# Altium schematic sheet KV2_MotionB67.SchDoc
size A3; PageSetup: Record=PageOptions|CenterHorizontal=True|CenterVertical=True|PrintScale=1.00|XCorrection=1.00|YCorrection=1.00|PrintKind=2|BorderSize=5000000|LeftOffset=0|BottomOffset=0|Orientation=2|PaperLength=1000|PaperWidth=1000|Scale=100|PaperSource=7|PrintQuality=-4|MediaType=1|DitherType=10|PaperKind=A3|PrintScaleMode=1
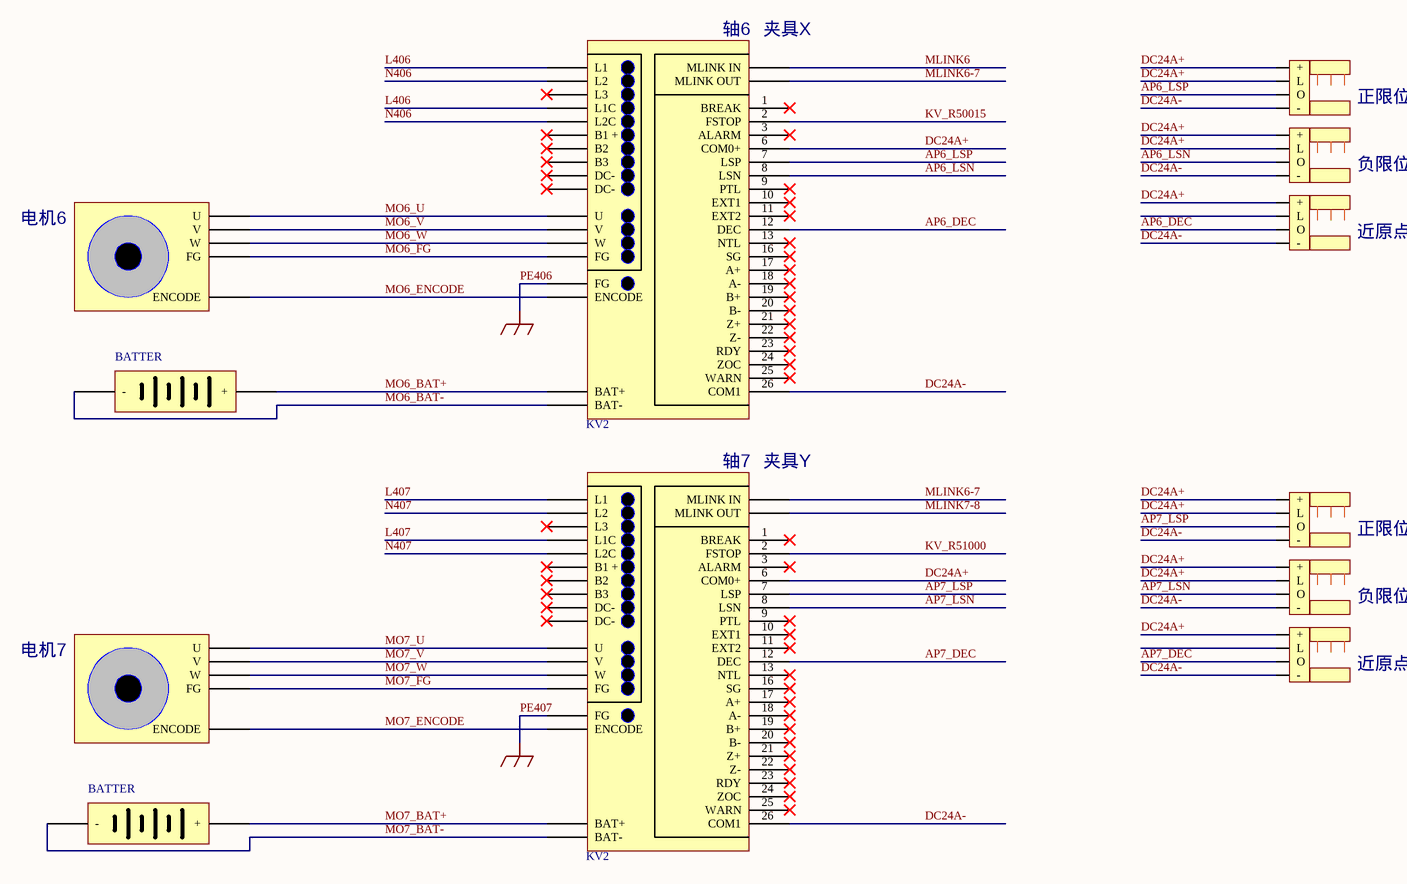
[diagram p0: KV2_MotionB67.SchDoc]

## Parts
(Parts that share a designator on the sheet are numbered #1, #2 ... from top to bottom, then left to right.)
*#1  KV2
*#2  SV-MXXXX  (value not drawn)
*#3  BATTER
*#4  KV2
*#5  SV-MXXXX  (value not drawn)
*#6  BATTER
原点光纤传感器#1  OMRON  E3X-HD  (value not drawn)
原点光纤传感器#2  OMRON  E3X-HD  (value not drawn)
原点光纤传感器#3  OMRON  E3X-HD  (value not drawn)
原点光纤传感器#4  OMRON  E3X-HD  (value not drawn)
原点光纤传感器#5  OMRON  E3X-HD  (value not drawn)
原点光纤传感器#6  OMRON  E3X-HD  (value not drawn)

## Nets
PE406: *#1.X43(FG) *#4.X43(FG)  [also labelled GND, PE407]
AP6_DEC: *#1.12(DEC) 原点光纤传感器#3.91(O)
AP6_LSN: *#1.8(LSN) 原点光纤传感器#2.91(O)
AP6_LSP: *#1.7(LSP) 原点光纤传感器#1.91(O)
AP7_DEC: *#4.12(DEC) 原点光纤传感器#6.91(O)
AP7_LSN: *#4.8(LSN) 原点光纤传感器#5.91(O)
AP7_LSP: *#4.7(LSP) 原点光纤传感器#4.91(O)
DC24A+: *#1.6(COM0+) *#4.6(COM0+) 原点光纤传感器#1.89(+) 原点光纤传感器#1.90(L) 原点光纤传感器#2.89(+) 原点光纤传感器#2.90(L) 原点光纤传感器#3.89(+) 原点光纤传感器#4.89(+) 原点光纤传感器#4.90(L) 原点光纤传感器#5.89(+) 原点光纤传感器#5.90(L) 原点光纤传感器#6.89(+)
DC24A-: *#1.26(COM1) *#4.26(COM1) 原点光纤传感器#1.92(-) 原点光纤传感器#2.92(-) 原点光纤传感器#3.92(-) 原点光纤传感器#4.92(-) 原点光纤传感器#5.92(-) 原点光纤传感器#6.92(-)
KV_R50015: *#1.2(FSTOP)
KV_R51000: *#4.2(FSTOP)
L406: *#1.X34(L1) *#1.X37(L1C)
L407: *#4.X34(L1) *#4.X37(L1C)
MLINK6: *#1.X44(MLINK_IN)
MLINK6-7: *#1.X44(MLINK_OUT) *#4.X44(MLINK_IN)
MLINK7-8: *#4.X44(MLINK_OUT)
MO6_BAT+: *#1.X44(BAT+) *#3.33(+)
MO6_BAT-: *#1.X44(BAT-) *#3.32(-)
MO6_ENCODE: *#1.X44(ENCODE) *#2.29(ENCODE)
MO6_FG: *#1.X43(FG) *#2.29(FG)
MO6_U: *#1.X43(DC-) *#2.27(U)
MO6_V: *#1.X43(V) *#2.28(V)
MO6_W: *#1.X43(W) *#2.29(W)
MO7_BAT+: *#4.X44(BAT+) *#6.33(+)
MO7_BAT-: *#4.X44(BAT-) *#6.32(-)
MO7_ENCODE: *#4.X44(ENCODE) *#5.29(ENCODE)
MO7_FG: *#4.X43(FG) *#5.29(FG)
MO7_U: *#4.X43(DC-) *#5.27(U)
MO7_V: *#4.X43(V) *#5.28(V)
MO7_W: *#4.X43(W) *#5.29(W)
N406: *#1.X35(L2) *#1.X38(L2C)
N407: *#4.X35(L2) *#4.X38(L2C)

Not connected (* = marked no-connect by the designer): *#1 1(BREAK)* 3(ALARM)* 9(PTL)* 10(EXT1)* 11(EXT2)* 13(NTL)* 16(SG)* 17(A+)* 18(A-)* 19(B+)* 20(B-)* 21(Z+)* 22(Z-)* 23(RDY)* 24(ZOC)* 25(WARN)* X36(L3)* X39(B1_+)* X40(B2)* X41(B3)* X42(DC-)*; *#4 1(BREAK)* 3(ALARM)* 9(PTL)* 10(EXT1)* 11(EXT2)* 13(NTL)* 16(SG)* 17(A+)* 18(A-)* 19(B+)* 20(B-)* 21(Z+)* 22(Z-)* 23(RDY)* 24(ZOC)* 25(WARN)* X36(L3)* X39(B1_+)* X40(B2)* X41(B3)* X42(DC-)*; 原点光纤传感器#3 90(L); 原点光纤传感器#6 90(L)

## Notes on the sheet
- (near *#1) 轴6
- (near *#1) 夹具X
- 正限位
- 负限位
- 电机6
- 近原点
- (near *#4) 轴7
- (near *#4) 夹具Y
- 电机7

## Library data of the parts
原点光纤传感器#1-原点光纤传感器#6 = OMRON_EE-SX671